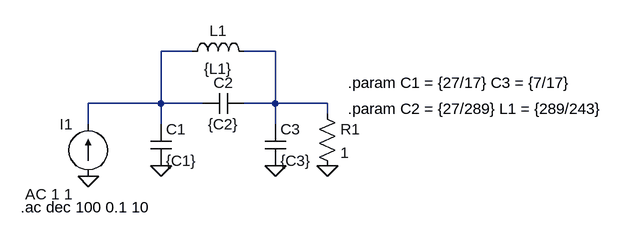
[diagram p0: schematic Ej2.asc]
Ej2.asc, the LTspice schematic file:
Version 4
SHEET 1 880 680
WIRE 128 16 80 16
WIRE 256 16 208 16
WIRE 80 96 80 16
WIRE 80 96 -32 96
WIRE 144 96 80 96
WIRE 256 96 256 16
WIRE 256 96 208 96
WIRE 336 96 256 96
WIRE 336 112 336 96
WIRE -32 128 -32 96
WIRE 80 128 80 96
WIRE 256 128 256 96
FLAG -32 208 0
FLAG 80 192 0
FLAG 256 192 0
FLAG 336 192 0
SYMBOL current -32 208 R180
WINDOW 0 24 80 Left 2
WINDOW 3 24 0 Left 2
WINDOW 123 24 -28 Left 2
WINDOW 39 0 0 Left 0
SYMATTR InstName I1
SYMATTR Value ""
SYMATTR Value2 AC 1 1
SYMBOL cap 64 128 R0
SYMATTR InstName C1
SYMATTR Value {C1}
SYMBOL cap 208 80 R90
WINDOW 0 0 32 VBottom 2
WINDOW 3 32 32 VTop 2
SYMATTR InstName C2
SYMATTR Value {C2}
SYMBOL ind 112 32 R270
WINDOW 0 32 56 VTop 2
WINDOW 3 5 56 VBottom 2
SYMATTR InstName L1
SYMATTR Value {L1}
SYMBOL cap 240 128 R0
SYMATTR InstName C3
SYMATTR Value {C3}
SYMBOL res 320 96 R0
SYMATTR InstName R1
SYMATTR Value 1
TEXT -136 256 Left 2 !.ac dec 100 0.1 10
TEXT 368 64 Left 2 !.param C1 = {27/17} C3 = {7/17}
TEXT 368 104 Left 2 !.param C2 = {27/289} L1 = {289/243}

The netlist it stands for:
* Ej2.asc
I1 0 N001 AC 1 1
C1 N001 0 {C1}
C2 N002 N001 {C2}
L1 N001 N002 {L1}
C3 N002 0 {C3}
R1 N002 0 1
.ac dec 100 0.1 10
.param C1 = {27/17} C3 = {7/17}
.param C2 = {27/289} L1 = {289/243}
.backanno
.end